# Altium project PCB_Project_Stethoscope.PrjPcb
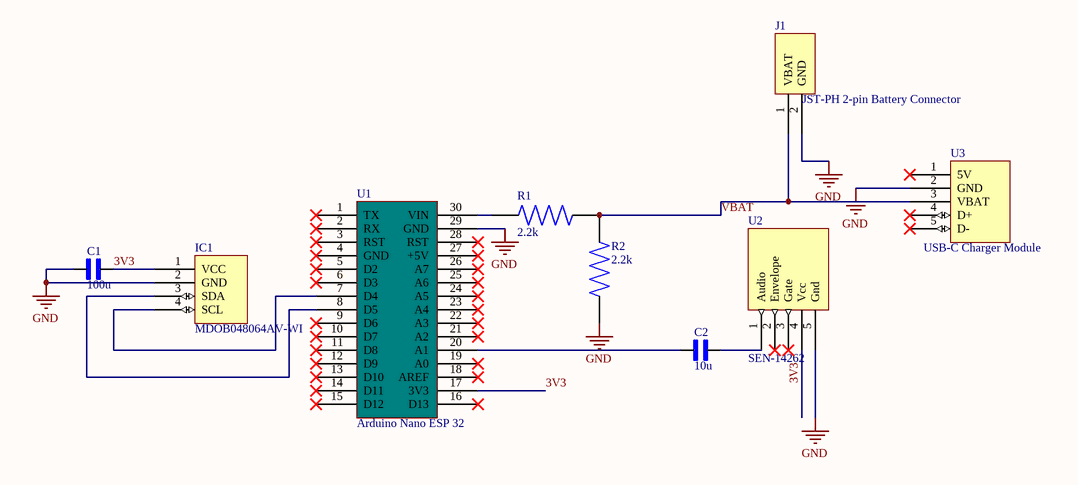
[diagram p0: Sheet1.SchDoc]
1 sheet, 9 parts. Net scope: global (net labels, ports and power ports of the same name join across sheets).
Board file: PCB3.PcbDoc

## Sheet Sheet1.SchDoc
size A; SheetNumber: 1; SheetTotal: 1

### Parts
C1  100u  [CAP]
C2  10u  [CAP]
IC1  MDOB048064AV-WI  [MDOB048064AV-WI]
J1  JST-PH 2-pin Battery Connector  [JST-PH 2-pin connector]
R1  2.2k  [RES]
R2  2.2k  [RES]
U1  Arduino Nano ESP 32  [PCBComponent_1 - duplicate]
U2  SEN-14262  [SEN-14262]
U3  USB-C Charger Module  [ADAFRUIT-4410]

### Nets
GND: C1.1 IC1.2(GND) J1.2(GND) R2.1 U1.29(GND) U2.5(Gnd) U3.2(GND)
3V3: C1.2 IC1.1(VCC) U1.17(3V3) U2.4(Vcc)
VBAT: J1.1(VBAT) R1.2 R2.2 U3.3(VBAT)
NetC2_1: C2.1 U1.20(A1)
NetC2_2: C2.2 U2.1(Audio)
NetIC1_3: IC1.3(SDA) U1.8(D5)
NetIC1_4: IC1.4(SCL) U1.7(D4)
NetR1_1: R1.1 U1.30(VIN)

Not connected (* = marked no-connect by the designer): U1 1(TX)* 2(RX)* 3(RST)* 4(GND)* 5(D2)* 6(D3)* 9(D6)* 10(D7)* 11(D8)* 12(D9)* 13(D10)* 14(D11)* 15(D12)* 16(D13)* 18(AREF)* 19(A0)* 21(A2)* 22(A3)* 23(A4)* 24(A5)* 25(A6)* 26(A7)* 27(+5V)* 28(RST)*; U2 2(Envelope)* 3(Gate)*; U3 1(5V)* 4(D+)* 5(D-)*

### Library data of the parts
C1 C2 = cap: capacitor; MF: AVX; MP: 0805YC103J4T2A; SnapEDA_Link: https://www.snapeda.com/parts/0805YC103J4T2A/AVX/view-part/?ref=snap; Package: 2012 AVX; Value: *; Check_prices: https://www.snapeda.com/parts/0805YC103J4T2A/AVX/view-part/?ref=eda
  C1: Supplier 1: RS; Supplier Part Number 1: 7296283P
  C2: Supplier 1: Avnet; Supplier Part Number 1: KGM31HR51A106KU
IC1 = MDOB048064AV-WI: LED; Supplier 1: Farnell; Supplier Part Number 1: MDOB048064AV-WI
J1 = JST-PH 2-pin connector: JST-PH 2-pin LiPo Battery Connector; Supplier 1: DigiKey; Supplier Part Number 1: 1528-4714-ND
R1 R2 = res: Resistor; MF: Yageo; MP: RC0805FR-07330RL; SnapEDA_Link: https://www.snapeda.com/parts/RC0805FR-07330RL/Yageo/view-part/?ref=snap; Package: 2012 Yageo; Value: *; Check_prices: https://www.snapeda.com/parts/RC0805FR-07330RL/Yageo/view-part/?ref=eda; Supplier 1: RS; Supplier Part Number 1: 2050472
U1 = Component_1_1: Supplier 1: Farnell; Supplier Part Number 1: ABX00092
U2 = SEN-14262: Audio sensor; Supplier 1: Arrow Electronics; Supplier Part Number 1: SEN-14262
U3 = ADAFRUIT-4410: ADAFRUIT 4410 MICROLIPO USBC MODULE; Supplier 1: DigiKey; Supplier Part Number 1: 1528-4410-ND